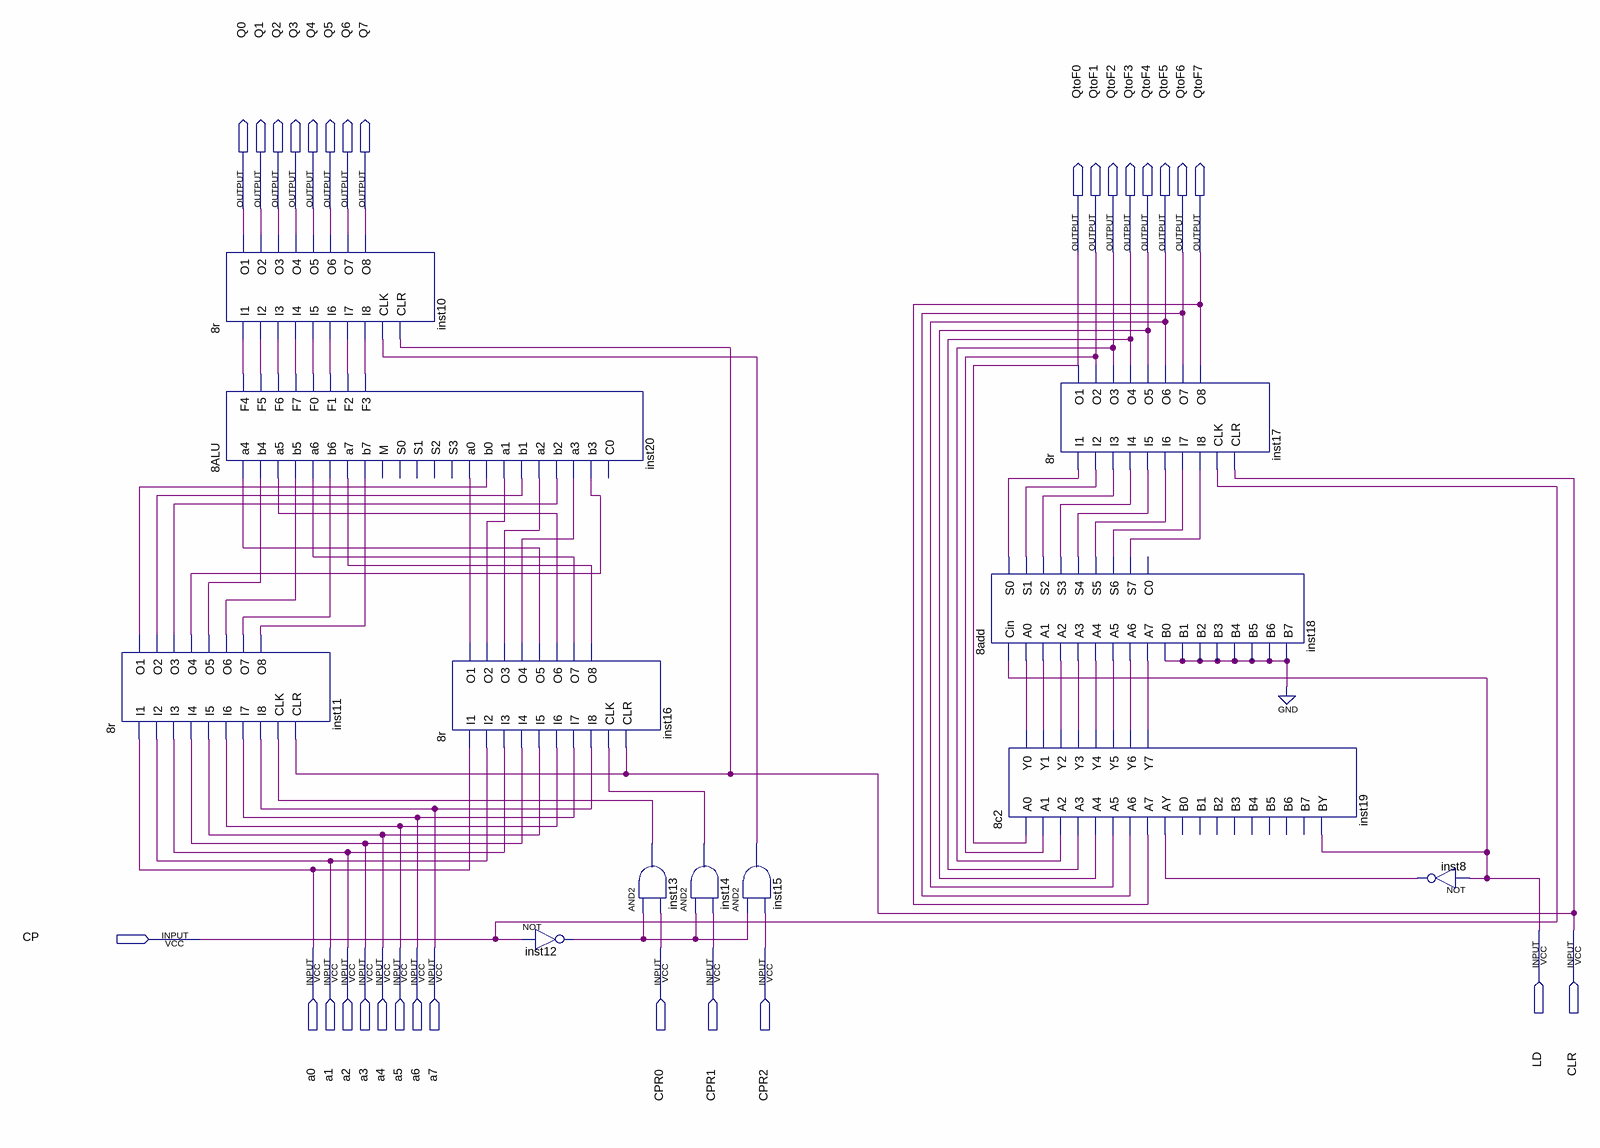
[diagram p0: schematic sheet]
// Quartus schematic Final.bdf as structural Verilog: 12 symbols, 30 pins
module Final (
  input  LD,
  input  CLR,
  input  CP,
  input  a0,
  input  a1,
  input  a2,
  input  a3,
  input  a4,
  input  a5,
  input  a6,
  input  a7,
  input  CPR0,
  input  CPR1,
  input  CPR2,
  output Q0,
  output Q1,
  output Q2,
  output Q3,
  output Q4,
  output Q5,
  output Q6,
  output Q7,
  output QtoF0,
  output QtoF1,
  output QtoF2,
  output QtoF3,
  output QtoF4,
  output QtoF5,
  output QtoF6,
  output QtoF7
);

  wire inst8_out, inst11_o1, inst11_o2, inst11_o3, inst11_o4, inst11_o5, inst11_o6, inst11_o7, inst11_o8,
       inst12_out, inst13_out, inst14_out, inst15_out, inst16_o1, inst16_o2, inst16_o3, inst16_o4, inst16_o5,
       inst16_o6, inst16_o7, inst16_o8, inst18_s0, inst18_s1, inst18_s2, inst18_s3, inst18_s4, inst18_s5,
       inst18_s6, inst18_s7, inst19_y0, inst19_y1, inst19_y2, inst19_y3, inst19_y4, inst19_y5, inst19_y6,
       inst19_y7, inst20_f0, inst20_f1, inst20_f2, inst20_f3, inst20_f4, inst20_f5, inst20_f6, inst20_f7;

  \8r  inst11 (
    .I1(a0), .I2(a1), .I3(a2), .I4(a3), .I5(a4), .I6(a5), .I7(a6), .I8(a7), .CLK(inst13_out), .CLR(CLR),
    .O1(inst11_o1), .O2(inst11_o2), .O3(inst11_o3), .O4(inst11_o4), .O5(inst11_o5), .O6(inst11_o6),
    .O7(inst11_o7), .O8(inst11_o8));
  \8r  inst10 (
    .I1(inst20_f4), .I2(inst20_f5), .I3(inst20_f6), .I4(inst20_f7), .I5(inst20_f0), .I6(inst20_f1),
    .I7(inst20_f2), .I8(inst20_f3), .CLK(inst15_out), .CLR(CLR), .O1(Q0), .O2(Q1), .O3(Q2), .O4(Q3), .O5(Q4),
    .O6(Q5), .O7(Q6), .O8(Q7));
  \8ALU  inst20 (
    .a4(inst16_o5), .b4(inst11_o5), .a5(inst16_o6), .b5(inst11_o6), .a6(inst16_o7), .b6(inst11_o7),
    .a7(inst16_o8), .b7(inst11_o8), .a0(inst16_o1), .b0(inst11_o1), .a1(inst16_o2), .b1(inst11_o2),
    .a2(inst16_o3), .b2(inst11_o3), .a3(inst16_o4), .b3(inst11_o4), .F4(inst20_f4), .F5(inst20_f5),
    .F6(inst20_f6), .F7(inst20_f7), .F0(inst20_f0), .F1(inst20_f1), .F2(inst20_f2), .F3(inst20_f3));  // open: M, S0, S1, S2, S3, C0
  \8r  inst16 (
    .I1(a0), .I2(a1), .I3(a2), .I4(a3), .I5(a4), .I6(a5), .I7(a6), .I8(a7), .CLK(inst14_out), .CLR(CLR),
    .O1(inst16_o1), .O2(inst16_o2), .O3(inst16_o3), .O4(inst16_o4), .O5(inst16_o5), .O6(inst16_o6),
    .O7(inst16_o7), .O8(inst16_o8));
  not inst12 (inst12_out, CP);
  and inst13 (inst13_out, inst12_out, CPR0);
  and inst14 (inst14_out, inst12_out, CPR1);
  and inst15 (inst15_out, inst12_out, CPR2);
  \8add  inst18 (
    .Cin(LD), .A0(inst19_y0), .A1(inst19_y1), .A2(inst19_y2), .A3(inst19_y3), .A4(inst19_y4), .A5(inst19_y5),
    .A6(inst19_y6), .A7(inst19_y7), .B0(1'b0), .B1(1'b0), .B2(1'b0), .B3(1'b0), .B4(1'b0), .B5(1'b0),
    .B6(1'b0), .B7(1'b0), .S0(inst18_s0), .S1(inst18_s1), .S2(inst18_s2), .S3(inst18_s3), .S4(inst18_s4),
    .S5(inst18_s5), .S6(inst18_s6), .S7(inst18_s7));  // open: C0
  \8c2  inst19 (
    .A0(QtoF0), .A1(QtoF1), .A2(QtoF2), .A3(QtoF3), .A4(QtoF4), .A5(QtoF5), .A6(QtoF6), .A7(QtoF7),
    .AY(inst8_out), .BY(LD), .Y0(inst19_y0), .Y1(inst19_y1), .Y2(inst19_y2), .Y3(inst19_y3), .Y4(inst19_y4),
    .Y5(inst19_y5), .Y6(inst19_y6), .Y7(inst19_y7));  // open: B0, B1, B2, B3, B4, B5, B6, B7
  \8r  inst17 (
    .I1(inst18_s0), .I2(inst18_s1), .I3(inst18_s2), .I4(inst18_s3), .I5(inst18_s4), .I6(inst18_s5),
    .I7(inst18_s6), .I8(inst18_s7), .CLK(CP), .CLR(CLR), .O1(QtoF0), .O2(QtoF1), .O3(QtoF2), .O4(QtoF3),
    .O5(QtoF4), .O6(QtoF5), .O7(QtoF6), .O8(QtoF7));
  not inst8 (inst8_out, LD);
endmodule
